# Altium schematic sheet MAIN-BRUSH-MOTOR .SchDoc
size A4; SheetNumber: 22; SheetTotal: 32
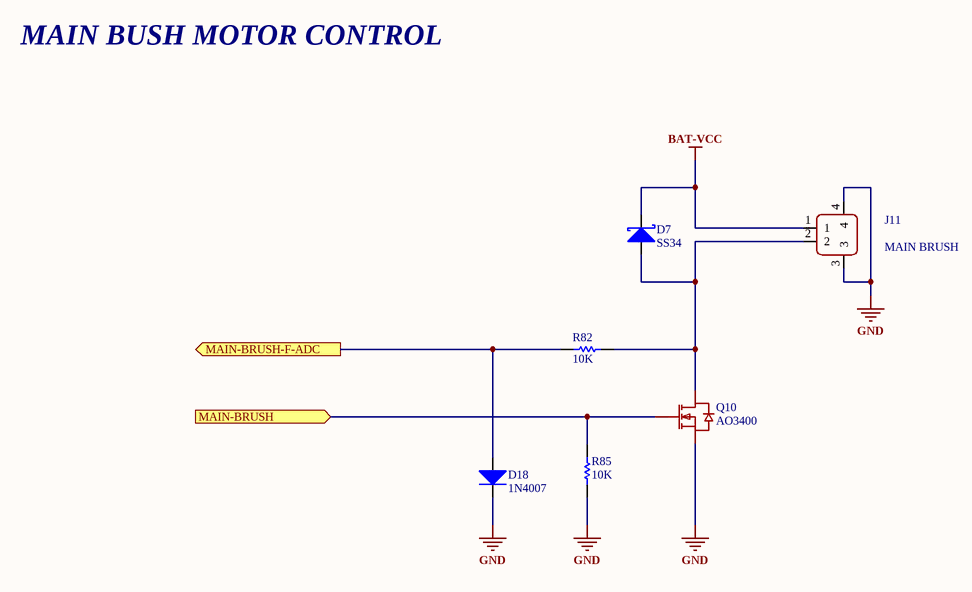
[diagram p0: MAIN-BRUSH-MOTOR .SchDoc]

## Parts
D7  SS34  [SMA]
D18  1N4007  [SOD123]
J11  MAIN BRUSH  [CONN-SMD_2P-P2.00_XUNPU_WAFER-PH2.0-2PWB]
Q10  AO3400  [SOT23-3D]
R82  10K  [RES-0402]
R85  10K  [RES-0402]

## Ports
MAIN-BRUSH (in, see Controller-RK3562-TOP[2B]), MAIN-BRUSH-F-ADC (out, see Controller-RK3562-TOP[2B])

## Nets
BAT-VCC: D7.2(K) J11.1
GND: D18.2(K) J11.3 J11.4 Q10.2(S) R85.2
MAIN-BRUSH: Q10.1(G) R85.1 ; port MAIN-BRUSH
MAIN-BRUSH-F-ADC: D18.1(A) R82.1 ; port MAIN-BRUSH-F-ADC
NetD7_1: D7.1(A) J11.2 Q10.3(D) R82.2

## Notes on the sheet
- MAIN BUSH MOTOR CONTROL

## Library data of the parts
D7 = DIODE-2: ManufacturingPartNumber: *; Manufacturer: *; SupplierPartNumber: *; Supplier: *; VoltageRate: *
D18 = DIODE-1: ManufacturingPartNumber: *; Manufacturer: *; SupplierPartNumber: *; Supplier: *; VoltageRate: *
J11 = HDRx2: ZX-ZH1.5-2PWT; ManufacturingPartNumber: *; Manufacturer: *; SupplierPartNumber: *; Supplier: *; VoltageRate: *
Q10 = N-MOS-SOT23: ManufacturingPartNumber: *; Manufacturer: *; SupplierPartNumber: *; Supplier: *; VoltageRate: *
R82 R85 = Resistor-1: ManufacturingPartNumber: *; Manufacturer: *; SupplierPartNumber: *; Supplier: *; VoltageRate: *